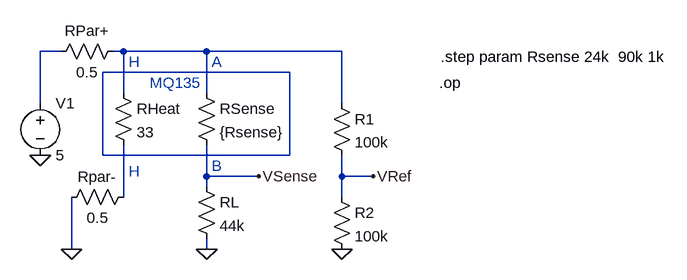
[diagram p0: schematic MQ135_Simulation.asc]
MQ135_Simulation.asc, the LTspice schematic file:
Version 4
SHEET 1 992 680
WIRE 0 48 -32 48
WIRE 96 48 80 48
WIRE 224 48 96 48
WIRE 432 48 224 48
WIRE 352 80 64 80
WIRE 96 112 96 48
WIRE 224 112 224 48
WIRE -32 128 -32 48
WIRE 432 128 432 48
WIRE 64 208 64 80
WIRE 352 208 352 80
WIRE 352 208 64 208
WIRE 224 240 224 192
WIRE 304 240 224 240
WIRE 432 240 432 208
WIRE 480 240 432 240
WIRE 224 256 224 240
WIRE 96 272 96 192
WIRE 432 272 432 240
WIRE 16 352 16 272
WIRE 224 352 224 336
FLAG -32 208 0
FLAG 224 352 0
FLAG 432 352 0
FLAG 304 240 VSense
FLAG 480 240 VRef
FLAG 16 352 0
SYMBOL voltage -32 112 R0
SYMATTR InstName V1
SYMATTR Value 5
SYMBOL res 208 96 R0
SYMATTR InstName RSense
SYMATTR Value {Rsense}
SYMBOL res 80 96 R0
SYMATTR InstName RHeat
SYMATTR Value 33
SYMBOL res 96 32 R90
WINDOW 0 0 56 VBottom 2
WINDOW 3 32 56 VTop 2
SYMATTR InstName RPar+
SYMATTR Value 0.5
SYMBOL res 112 256 R90
WINDOW 0 0 56 VBottom 2
WINDOW 3 32 56 VTop 2
SYMATTR InstName Rpar-
SYMATTR Value 0.5
SYMBOL res 208 240 R0
SYMATTR InstName RL
SYMATTR Value 44k
SYMBOL res 416 112 R0
SYMATTR InstName R1
SYMATTR Value 100k
SYMBOL res 416 256 R0
SYMATTR InstName R2
SYMATTR Value 100k
TEXT 584 56 Left 2 !.step param Rsense 24k  90k 1k
TEXT 582 96 Left 2 !.op
TEXT 136 96 Left 2 ;MQ135
TEXT 104 232 Left 2 ;H
TEXT 104 64 Left 2 ;H
TEXT 232 64 Left 2 ;A
TEXT 232 224 Left 2 ;B

The netlist it stands for:
* MQ135_Simulation.asc
V1 N001 0 5
RSense N002 VSense {Rsense}
RHeat N002 N004 33
RPar+ N002 N001 0.5
Rpar- N004 0 0.5
RL VSense 0 44k
R1 N002 VRef 100k
R2 VRef 0 100k
.step param Rsense 24k  90k 1k
.op
* MQ135
* H
* H
* A
* B
.backanno
.end